# EAGLE design LM3404prototype (EAGLE 7.0.0)
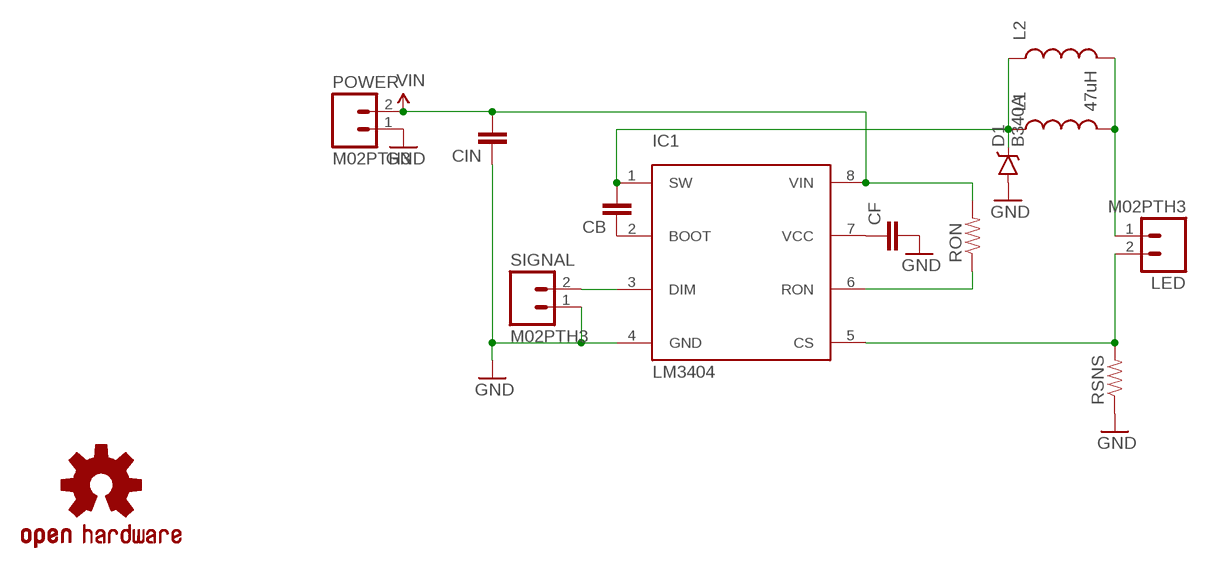
[diagram p0: schematic, sheet 1]

## Parts
CB  CAP1206  [1206]
CF  CAP1206  [1206]
CIN  CAP1206  [1206]
D1  B340A  DIODE-SCHOTTKY-B340A  [SMA-DIODE]
IC1  LM3404  [SO8]
L1  47uH  INDUCTOR68UH-1A  [CR75]
L2  INDUCTORSDR1105  [B82462G]
LED  M02PTH3  [1X02_LONGPADS]
LOGO1  OSHW-LOGOS  [OSHW-LOGO-S]
POWER  M02PTH3  [1X02_LONGPADS]
RON  RESISTOR1206  [1206]
RSNS  RESISTOR1206  [1206]
SIGNAL  M02PTH3  [1X02_LONGPADS]

## Nets
GND: CF.2 CIN.1 D1.A IC1.4(GND) POWER.1 RSNS.1 SIGNAL.1
N$1: CF.1 IC1.7(VCC)
N$2: CB.1 IC1.2(BOOT)
N$4: CB.2 D1.C IC1.1(SW) L1.P$1 L2.P$1
N$5: IC1.5(CS) LED.2 RSNS.2
N$6: IC1.6(RON) RON.1
N$8: IC1.3(DIM) SIGNAL.2
N$9: L1.P$2 L2.P$2 LED.1
VIN: CIN.2 IC1.8(VIN) POWER.2 RON.2

## Library data of the parts
CB CF CIN = SparkFun-Capacitors:CAP: Capacitor Standard 0603 ceramic capacitor, and 0.1" leaded capacitor.
D1 = SparkFun-DiscreteSemi:DIODE-SCHOTTKY: Schottky diodes in SFE's production catalog BAT20J 1A 23V 0.62Vf RB751 120mA 40V 0.37Vf PMEG4005EJ 0.5A 40V 0.42Vf MBRA140 1A 40V 0.5Vf B340A 3A 40V SMA; PROD_ID: DIO-09886
IC1 = LM3404:LM3404
L1 = SparkFun-Passives:INDUCTOR: Inductors Basic Inductor/Choke - 0603 and 1206. Footprints are not proven and vary greatly between part numbers. SRN6045- 33uH, 20% 1.4A SDR0403-560KL - 56uH, 10%, 500mA RMS/740mA peak; PROD_ID: NDUC-09739; VALUE: 68uH
L2 = Michael-Passives:INDUCTOR: Inductors Basic Inductor/Choke - 0603 and 1206. Footprints are not proven and vary greatly between part numbers. SRN6045- 33uH, 20% 1.4A SDR0403-560KL - 56uH, 10%, 500mA RMS/740mA peak; TEST: test thsi
LED POWER SIGNAL = SparkFun-Connectors:M02: Standard 2-pin 0.1" header. Use with - straight break away headers ( PRT-00116) - right angle break away headers (PRT-00553) - swiss pins (PRT-00743) - machine pins (PRT-00117) - female headers (PRT-00115) Molex polarized connector foot print use with: PRT-08233 with associated crimp pins and housings. 2.54_SCREWTERM for use with PRT-10571. 3.5mm Screw Terminal footprints for PRT-08084 5mm Screw Terminal footprints for use with PRT-08432
LOGO1 = SparkFun-Aesthetics:OSHW-LOGO: Open Source Hardware Logo This logo indicates the piece of hardware it is found on incorporates a OSHW license and/or adheres to the definition of open source hardware found here: http://freedomdefined.org/OSHW
RON RSNS = SparkFun-Resistors:RESISTOR: Resistor Basic schematic elements and footprints for 0603, 1206, and PTH resistors.

## Board
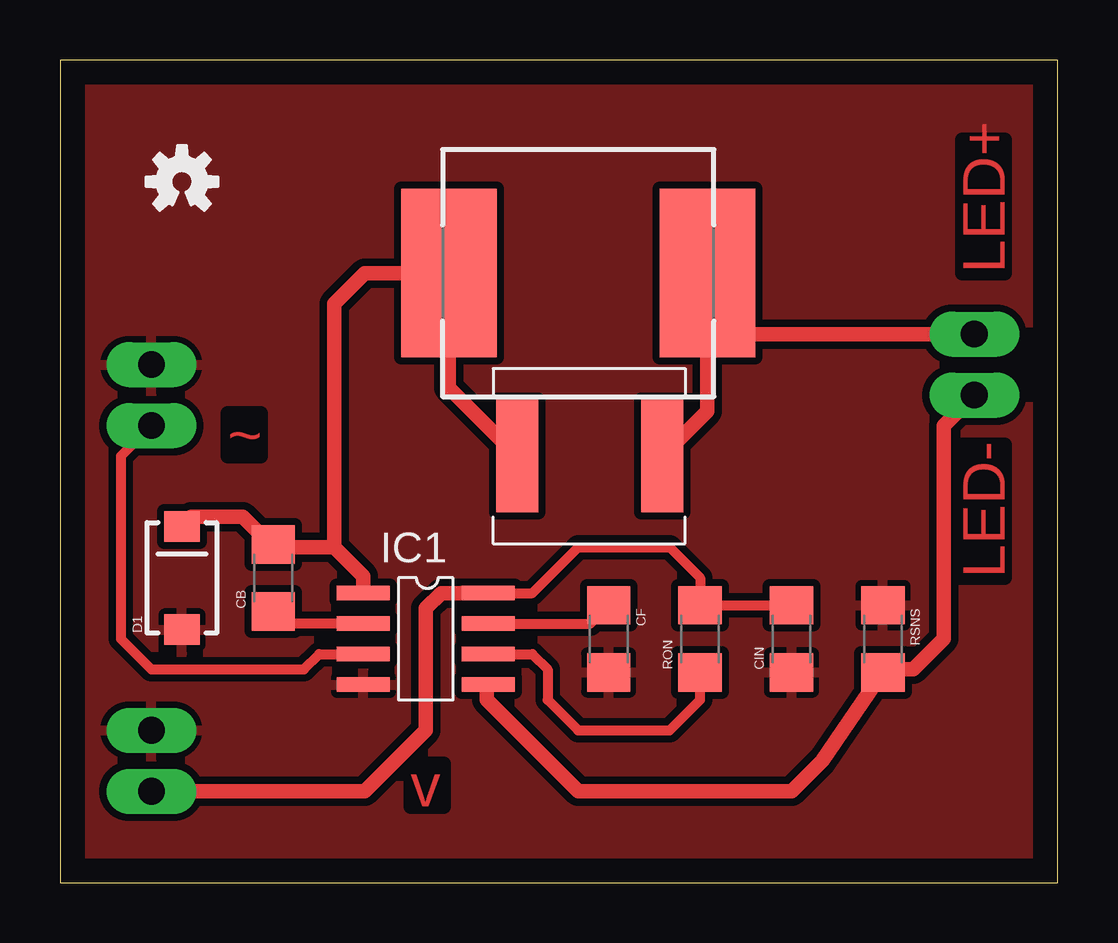
[diagram p1: board, top side]

Size 41.58 x 34.28 mm. Coordinates in mm from the lower left corner, seen from the top.
Outline: 0,0 41.58,0 41.58,34.28 0,34.28 0,0
Copper layers (1*16): Top 0.035mm / dielectric 1.5mm / Bottom 0.035mm
Design rules "default": minimum track width 10mil, minimum drill 24mil, track to track 8mil, track to pad 8mil, pad to pad 8mil, via to via 8mil, smd to smd 8mil, copper to edge 40mil, drill to drill 8mil, minimum pad ring 10mil, minimum via ring 8mil, stop-mask expansion 4mil, vias tented up to drill 0mil, thermal gap 10mil

### Footprints (pad centres in the part's own frame; a part is rotated, then mirrored left to right if it is on the bottom)
1206 = smd 1.6 x 1.8: 1 -1.4,0; 2 1.4,0
SMA-DIODE = smd 1.27 x 1.47: A -2.15,0; C 2.15,0
SO8 = smd 0.6 x 2.2: 1 -1.905,-2.6; 2 -0.635,-2.6; 3 0.635,-2.6; 4 1.905,-2.6; 5 1.905,2.6; 6 0.635,2.6; 7 -0.635,2.6; 8 -1.905,2.6
CR75 = smd 1.75 x 4.7: P$1 0,0; P$2 6.05,0
B82462G = smd 7.01 x 3.988: P$1 0,5.385; P$2 0,-5.385
1X02_LONGPADS = drill 1.118 pad 1.88 long: 1 0,0; 2 2.54,0

### Placement (x,y rotation side)
CB  8.89,12.7 90 top
CF  22.86,10.16 270 top
CIN  30.48,10.16 90 top
D1  5.08,12.7 90 top
IC1  15.24,10.16 270 top
L1  19.05,17.78 0 top
L2  21.59,25.4 90 top
LED  38.1,22.86 270 top
LOGO1  5.08,29.21 0 top
POWER  3.81,6.35 270 top
RON  26.67,10.16 90 top
RSNS  34.29,10.16 270 top
SIGNAL  3.81,21.59 270 top

### Tracks (layer width: path | path; a pad name or v marks a point on that pad's centre or on a via)
GND
  pour Top (isolate 0.305): 0,34.29 41.91,34.29 41.91,0 0,0
N$1
  Top 0.406: IC1.7 22.09,10.79 CF.1
N$2
  Top 0.406: IC1.2 8.89,10.79 CB.1
N$4
  Top 0.61: IC1.1 12.64,12.76 11.43,13.97 | 11.43,13.97 9.02,13.97 CB.2 8.76,14.1 7.62,15.24 5.47,15.24 D1.C | 11.43,13.97 11.43,24.13 12.7,25.4 L2.P$1 16.2,20.62 L1.P$1
N$5
  Top 0.61: IC1.5 17.78,8.2 17.78,7.62 21.59,3.81 30.48,3.81 31.75,5.08 RSNS.2 34.42,8.89 35.56,8.89 36.83,10.16 36.83,19.05 LED.2
N$6
  Top 0.406: IC1.6 19.68,9.53 20.32,8.89 20.32,7.62 21.59,6.35 25.4,6.35 26.67,7.62 RON.1
N$8
  Top 0.406: SIGNAL.2 2.54,17.78 2.54,10.16 3.81,8.89 10.16,8.89 10.79,9.53 IC1.3
N$9
  Top 0.61: L1.P$2 26.98,19.66 L2.P$2 27.94,24.43 27.94,22.86 LED.1
VIN
  Top 0.406: IC1.8 19.68,12.06 21.59,13.97 25.4,13.97 26.67,12.7 RON.2 CIN.2
  Top 0.61: POWER.2 12.7,3.81 15.24,6.35 15.24,11.43 15.88,12.06 IC1.8

### Text on the board
Top: LED+ | ~ | LED- | v